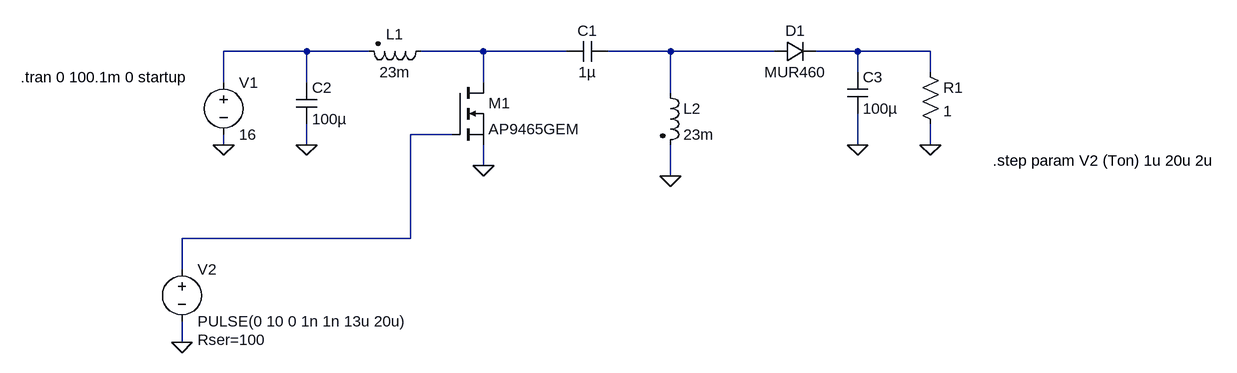
[diagram p0: schematic Sepic_V3.asc]
Sepic_V3.asc, the LTspice schematic file:
Version 4
SHEET 1 1424 680
WIRE -96 128 -224 128
WIRE 0 128 -96 128
WIRE 176 128 80 128
WIRE 304 128 176 128
WIRE 464 128 368 128
WIRE 624 128 464 128
WIRE 752 128 688 128
WIRE 864 128 752 128
WIRE 752 160 752 128
WIRE 864 160 864 128
WIRE -224 176 -224 128
WIRE -96 176 -96 128
WIRE 176 176 176 128
WIRE 464 192 464 128
WIRE 128 256 64 256
WIRE -224 272 -224 256
WIRE -96 272 -96 240
WIRE 752 272 752 224
WIRE 864 272 864 240
WIRE 176 304 176 272
WIRE 464 320 464 272
WIRE 64 416 64 256
WIRE 64 416 -288 416
WIRE -288 464 -288 416
WIRE -288 576 -288 544
FLAG 752 272 0
FLAG 864 272 0
FLAG -96 272 0
FLAG -224 272 0
FLAG -288 576 0
FLAG 176 304 0
FLAG 464 320 0
SYMBOL voltage -224 160 R0
WINDOW 123 0 0 Left 2
WINDOW 39 0 0 Left 2
SYMATTR InstName V1
SYMATTR Value 16
SYMBOL res 848 144 R0
SYMATTR InstName R1
SYMATTR Value 1
SYMBOL ind2 96 112 R90
WINDOW 0 5 56 VBottom 2
WINDOW 3 32 56 VTop 2
SYMATTR InstName L1
SYMATTR Value 23m
SYMATTR Type ind
SYMATTR SpiceLine Ipk=4.34 Rser=0.0672 Rpar=4957.99 Cpar=0
SYMBOL diode 624 144 R270
WINDOW 0 32 32 VTop 2
WINDOW 3 0 32 VBottom 2
SYMATTR InstName D1
SYMATTR Value MUR460
SYMBOL cap -112 176 R0
SYMATTR InstName C2
SYMATTR Value 100µ
SYMBOL cap 736 160 R0
SYMATTR InstName C3
SYMATTR Value 100µ
SYMBOL voltage -288 448 R0
WINDOW 123 0 0 Left 2
WINDOW 39 24 124 Left 2
SYMATTR SpiceLine Rser=100
SYMATTR InstName V2
SYMATTR Value PULSE(0 10 0 1n 1n 13u 20u)
SYMBOL nmos 128 176 R0
SYMATTR InstName M1
SYMATTR Value AP9465GEM
SYMBOL cap 368 112 R90
WINDOW 0 0 32 VBottom 2
WINDOW 3 32 32 VTop 2
SYMATTR InstName C1
SYMATTR Value 1µ
SYMBOL ind2 448 176 R0
SYMATTR InstName L2
SYMATTR Value 23m
SYMATTR Type ind
SYMATTR SpiceLine Ipk=4.34 Rser=0.0672 Rpar=4957.99 Cpar=0
TEXT -536 168 Left 2 !.tran 0 100.1m 0 startup
TEXT 960 296 Left 2 !.step param V2 (Ton) 1u 20u 2u

The netlist it stands for:
* Sepic_V3.asc
V1 N001 0 16
R1 N004 0 1
L1 N002 N001 23m Ipk=4.34 Rser=0.0672 Rpar=4957.99 Cpar=0
D1 N003 N004 MUR460
C2 N001 0 100µ
C3 N004 0 100µ
V2 N005 0 PULSE(0 10 0 1n 1n 13u 20u) Rser=100
M1 N002 N005 0 0 AP9465GEM
C1 N003 N002 1µ
L2 N003 0 23m Ipk=4.34 Rser=0.0672 Rpar=4957.99 Cpar=0
.model D D
.lib standard.dio
.model NMOS NMOS
.model PMOS PMOS
.lib standard.mos
.tran 0 100.1m 0 startup
.step param V2 (Ton) 1u 20u 2u
.backanno
.end